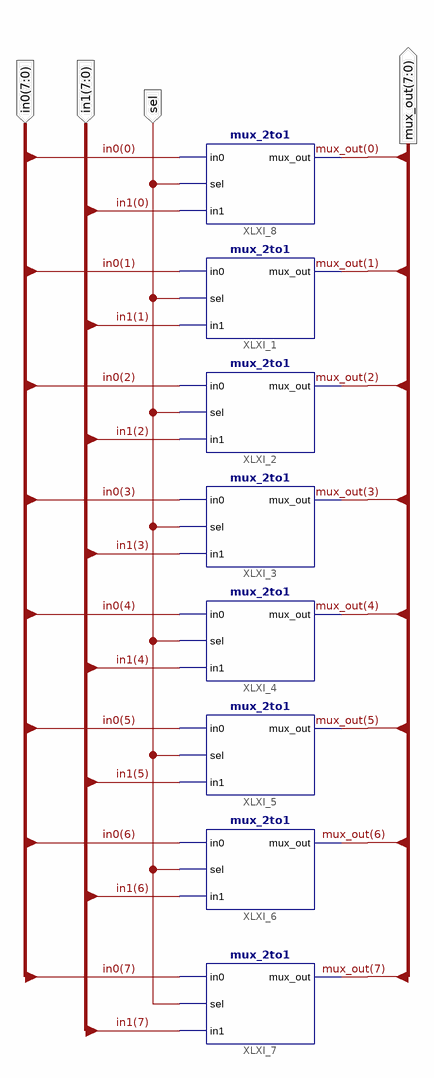
[diagram p0: schematic sheet 1]
// Xilinx ISE schematic mux_2to1_8bit.sch (spartan3e) as structural Verilog: 8 symbols, 4 ports
module mux_2to1_8bit (
  input  [7:0] in0,
  input  [7:0] in1,
  input  sel,
  output [7:0] mux_out
);

  mux_2to1 XLXI_1 (.in0(in0[1]), .sel(sel), .in1(in1[1]), .mux_out(mux_out[1]));
  mux_2to1 XLXI_2 (.in0(in0[2]), .sel(sel), .in1(in1[2]), .mux_out(mux_out[2]));
  mux_2to1 XLXI_3 (.in0(in0[3]), .sel(sel), .in1(in1[3]), .mux_out(mux_out[3]));
  mux_2to1 XLXI_4 (.in0(in0[4]), .sel(sel), .in1(in1[4]), .mux_out(mux_out[4]));
  mux_2to1 XLXI_5 (.in0(in0[5]), .sel(sel), .in1(in1[5]), .mux_out(mux_out[5]));
  mux_2to1 XLXI_6 (.in0(in0[6]), .sel(sel), .in1(in1[6]), .mux_out(mux_out[6]));
  mux_2to1 XLXI_7 (.in0(in0[7]), .sel(sel), .in1(in1[7]), .mux_out(mux_out[7]));
  mux_2to1 XLXI_8 (.in0(in0[0]), .sel(sel), .in1(in1[0]), .mux_out(mux_out[0]));
endmodule
